# EAGLE design LDConnector (EAGLE 7.7.0)
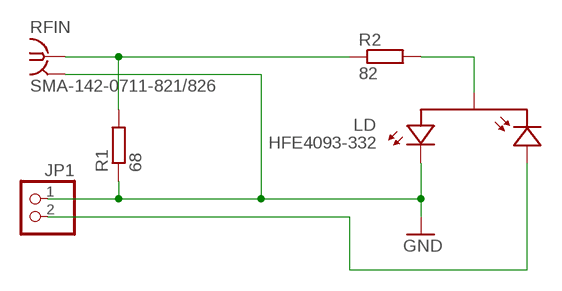
[diagram p0: schematic, sheet 1]

## Parts
JP1  PINHD-1X2/90  [1X02/90]
LD  HFE4093-332  [HFE4093-332-EDGE]
R1  68  R-EU_R0603  [R0603]
R2  82  R-EU_R0603  [R0603]
RFIN  SMA-142-0711-821/826  [J502-ND-142-0711-821/826]

## Nets
GND: JP1.1 LD.1-LD-CATHODE(LDC) R1.1 RFIN.G@1 RFIN.G@2 RFIN.G@3 RFIN.G@4
N$1: LD.2-PD-CATHODE-LD-ANODE(LDA-PDC) R2.2
N$2: R1.2 R2.1 RFIN.1
N$3: JP1.2 LD.3-PD-ANODE(PDA)

## Library data of the parts
JP1 = pinhead:PINHD-1X2: PIN HEADER
LD = laser diode:HFE4093-332
R1 R2 = rcl:R-EU_: RESISTOR, European symbol
RFIN = con-coax:SMA-: SMA 50 Ohm End Launch Jack Receptacle - Round Contact Johnson Components Source: www.johnsoncomponents.com .. J502-ND.pdf; MF: JOHNSON COMPONENTS; MPN: 142-0711-821; OC_FARNELL: 1019328; OC_NEWARK: 16F3627

## Board
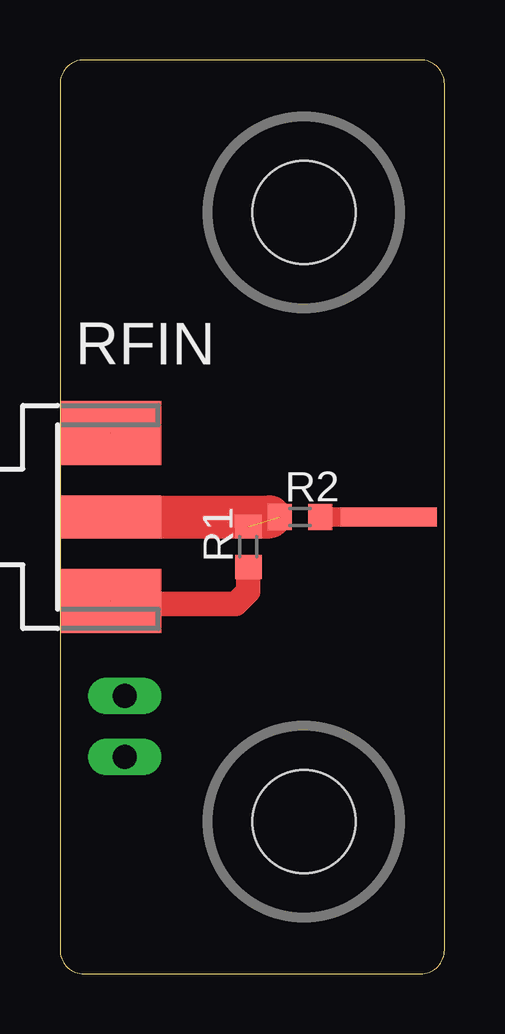
[diagram p1: board, top side]
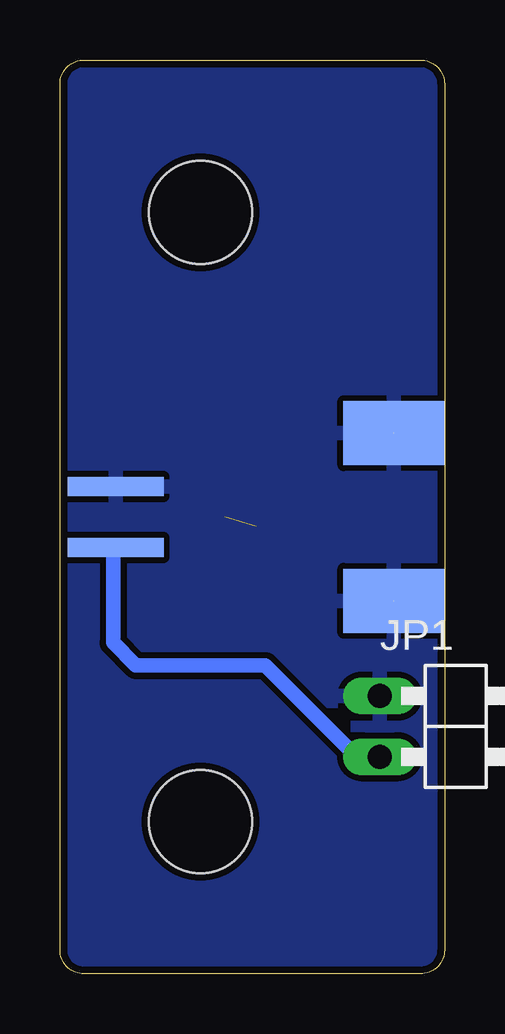
[diagram p2: board, bottom side, seen from below]

Size 16.02 x 38.1 mm. Coordinates in mm from the lower left corner, seen from the top.
Outline: 0,37.1 0,1 arc90 1,0 15.02,0 arc90 16.02,1 16.02,37.1 arc90 15.02,38.1 1,38.1 arc90 0,37.1
Copper layers (1*16): Top 0.035mm / dielectric 1.6mm / Bottom 0.035mm
Design rules "Elecrow_2-layer_PCB_eagle_rule *": minimum track width 6mil, minimum drill 12mil, track to track 10mil, track to pad 10mil, pad to pad 10mil, via to via 10mil, smd to smd 0mil, copper to edge 0.3mm, drill to drill 10mil, minimum pad ring 6mil, minimum via ring 6mil, stop-mask expansion 0mil, vias tented up to drill 100mil, thermal gap 10mil
Holes 4.3 mm at 10.16,31.75 10.16,6.35

### Footprints (pad centres in the part's own frame; a part is rotated, then mirrored left to right if it is on the bottom)
1X02/90 = drill 1.016 long: 1 -1.27,-3.81; 2 1.27,-3.81
HFE4093-332-EDGE = smd 4 x 0.8: 1-LD-CATHODE -2.118,0; 3-PD-ANODE -2.118,-2.54 | smd 4 x 0.8 bottom: 2-PD-CATHODE-LD-ANODE -2.118,-1.27
R0603 = smd 1 x 1.1: 1 -0.85,0; 2 0.85,0
J502-ND-142-0711-821/826 = smd 4.191 x 1.778: 1 2.115,0 | smd 4.191 x 2.667: G@1 2.115,3.495; G@2 2.115,-3.495 | smd 4.191 x 2.667 bottom: G@3 2.115,3.495; G@4 2.115,-3.495

### Placement (x,y rotation side)
JP1  -1.11,10.32 270 bottom
LD  11.59,20.32 0 bottom
R1  7.85,17.81 90 top
R2  10,19.05 0 top
RFIN  0,19.05 0 top

### Tracks (layer width: path | path; a pad name or v marks a point on that pad's centre or on a via)
GND  (2 unrouted)
  Top 1.016: R1.1 7.85,15.94 7.33,15.42 2.12,15.42 RFIN.G@4
  pour Bottom: -1.27,38.1 17.78,38.1 17.78,0 0,0
N$1
  Top 0.813: LD.2-PD-CATHODE-LD-ANODE R2.2
N$2  (1 unrouted)
  Top 1.016: R1.2 7.53,19.05 RFIN.1
N$3
  Bottom 0.61: LD.3-PD-ANODE 13.81,17.73 13.81,13.81 12.86,12.86 7.46,12.86 3.65,9.05 JP1.2
N$4
  Top 1.8: 3.33,19.05 8.73,19.05

### Text on the board
tDocu: 1 LDC / 2 PDC+LDA (GND) / 3 PDA | 2 | PDA | Mitch / Cox / 2016
bDocu: M6 | 1 | 3 | LDConnector v1.0 2016